# Altium schematic sheet Digital_DSPv3.SchDoc
size 508 x 508 mm
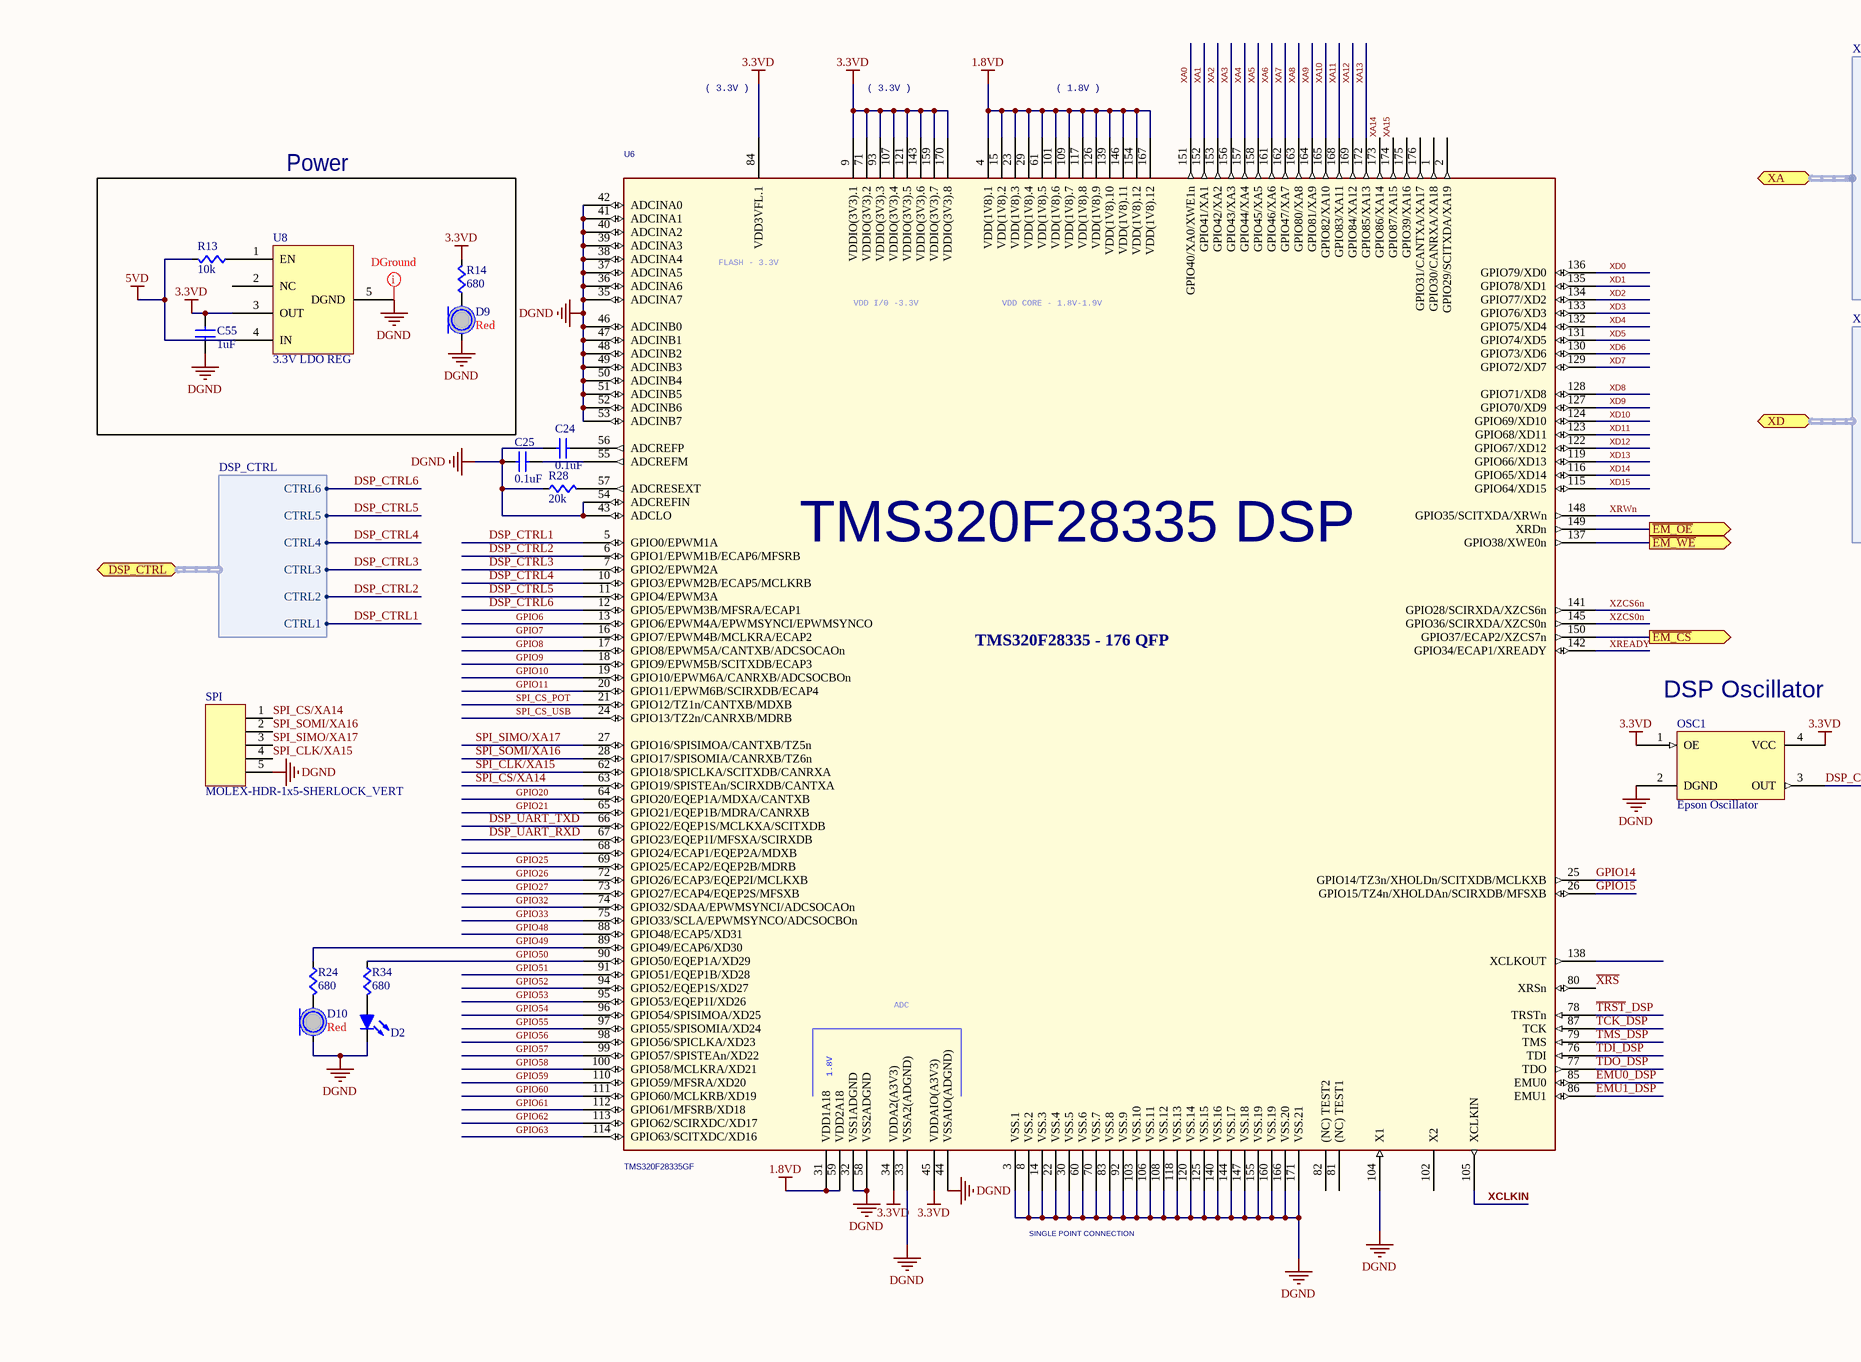
[diagram p0: Digital_DSPv3.SchDoc, top left]
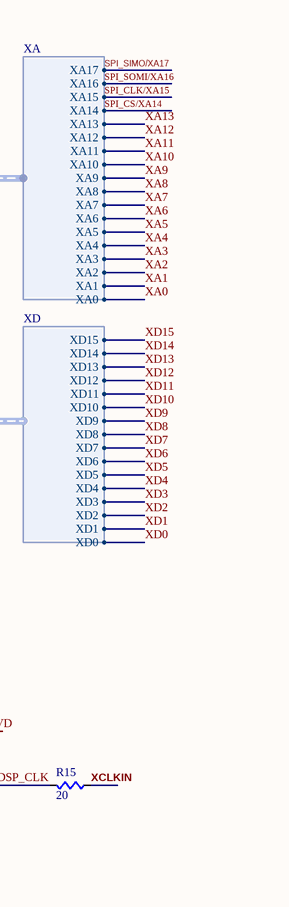
[diagram p1: Digital_DSPv3.SchDoc, top right]
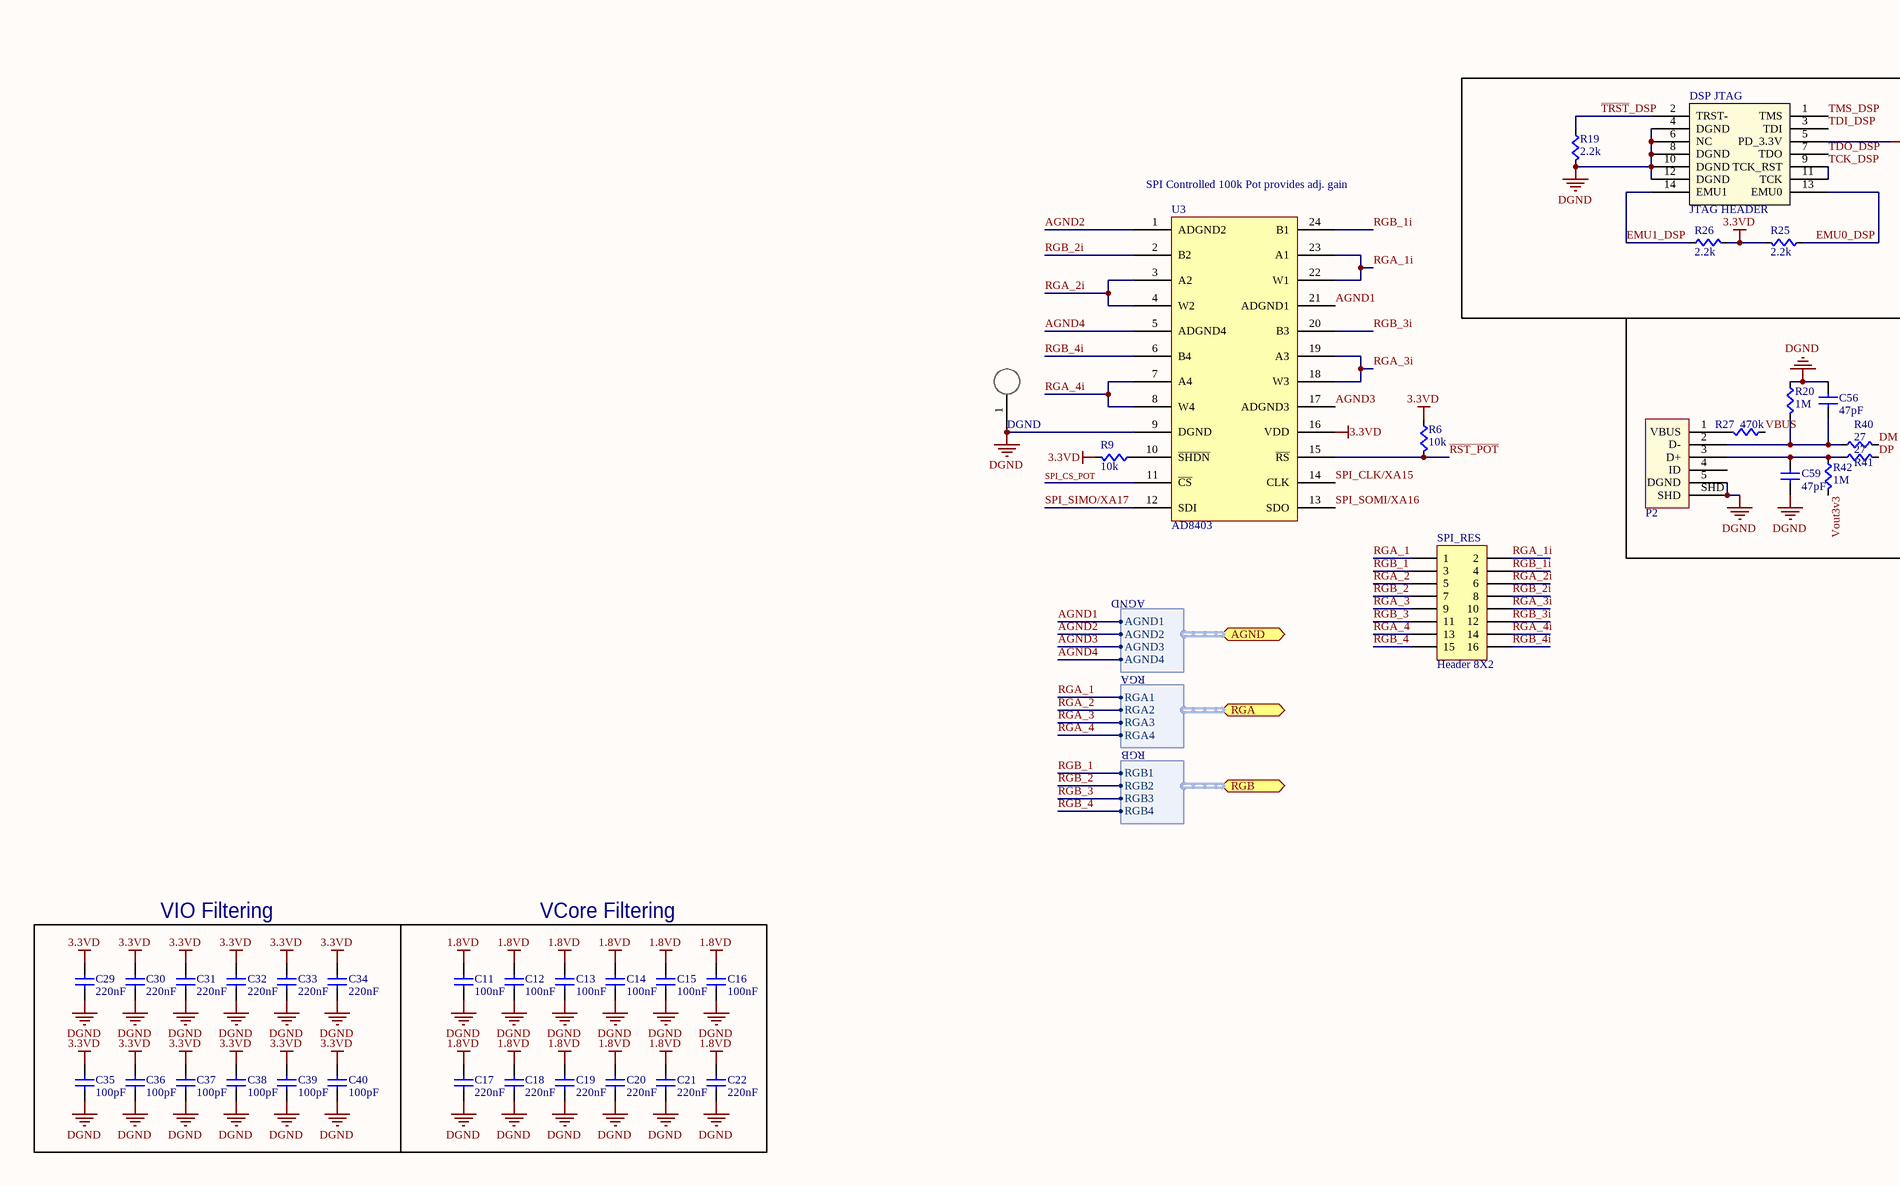
[diagram p2: Digital_DSPv3.SchDoc, bottom left]
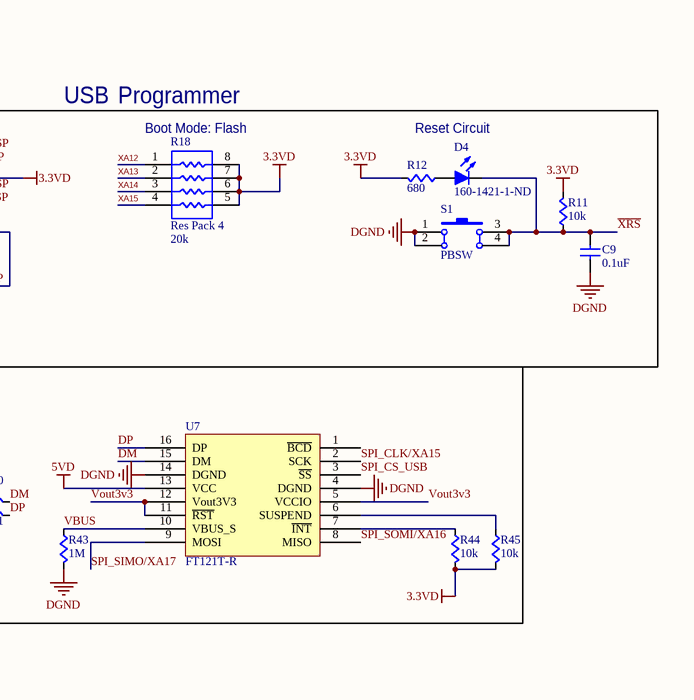
[diagram p3: Digital_DSPv3.SchDoc, bottom right]

## Parts
C9  value 0.1uF  [CAPC0603]  (hidden comment: Cap)
C11  value 100nF  [CAPC0603]  (hidden comment: Cap)
C12  value 100nF  [CAPC0603]  (hidden comment: Cap)
C13  value 100nF  [CAPC0603]  (hidden comment: Cap)
C14  value 100nF  [CAPC0603]  (hidden comment: Cap)
C15  value 100nF  [CAPC0603]  (hidden comment: Cap)
C16  value 100nF  [CAPC0603]  (hidden comment: Cap)
C17  value 220nF  [CAPC0603]  (hidden comment: Cap)
C18  value 220nF  [CAPC0603]  (hidden comment: Cap)
C19  value 220nF  [CAPC0603]  (hidden comment: Cap)
C20  value 220nF  [CAPC0603]  (hidden comment: Cap)
C21  value 220nF  [CAPC0603]  (hidden comment: Cap)
C22  value 220nF  [CAPC0603]  (hidden comment: Cap)
C24  value 0.1uF  [CAPC0603]  (hidden comment: Cap1206)
C25  value 0.1uF  [CAPC0603]  (hidden comment: Cap1206)
C29  value 220nF  [CAPC0603]  (hidden comment: Cap)
C30  value 220nF  [CAPC0603]  (hidden comment: Cap)
C31  value 220nF  [CAPC0603]  (hidden comment: Cap)
C32  value 220nF  [CAPC0603]  (hidden comment: Cap)
C33  value 220nF  [CAPC0603]  (hidden comment: Cap)
C34  value 220nF  [CAPC0603]  (hidden comment: Cap)
C35  value 100pF  [CAPC0603]  (hidden comment: Cap)
C36  value 100pF  [CAPC0603]  (hidden comment: Cap)
C37  value 100pF  [CAPC0603]  (hidden comment: Cap)
C38  value 100pF  [CAPC0603]  (hidden comment: Cap)
C39  value 100pF  [CAPC0603]  (hidden comment: Cap)
C40  value 100pF  [CAPC0603]  (hidden comment: Cap)
C55  value 1uF  [CAPC0603]  (hidden comment: Cap1206)
C56  value 47pF  [CAPC0603]  (hidden comment: Cap1206)
C59  value 47pF  [CAPC0603]  (hidden comment: Cap1206)
D2  LED-RED  [LED0805-RED]  (value not drawn)
D4  Supplier Part Number: 160-1421-1-ND  [LED0805-RED]  (hidden comment: LED-RED)
D9  Color: Red  [LED0805]  (hidden comment: LED)
D10  Color: Red  [LED0805]  (hidden comment: LED)
DGND  Test_Point  [TP]  (value not drawn)
DSP_JTAG  JTAG HEADER  [JTAG HEADER - 14]
OSC1  Epson Oscillator  [Oscillator]
P2  USB Micro  [10118192-0001LF]  (value not drawn)
R6  value 10k  [RES0603]  (hidden comment: Res)
R9  value 10k  [RES0603]  (hidden comment: Res)
R11  value 10k  [RES0603]  (hidden comment: Res)
R12  value 680  [RES0603]  (hidden comment: Res)
R13  value 10k  [RES0603]  (hidden comment: Res)
R14  value 680  [RES0603]  (hidden comment: Res)
R15  value 20  [RES0603]  (hidden comment: Res)
R18  Res Pack 4  value 20k  [SO-8]
R19  value 2.2k  [RES0603]  (hidden comment: Res)
R20  value 1M  [RES0603]  (hidden comment: Res)
R24  value 680  [RES0603]  (hidden comment: Res)
R25  value 2.2k  [RES0603]  (hidden comment: Res)
R26  value 2.2k  [RES0603]  (hidden comment: Res)
R27  value 470k  [RES0603]  (hidden comment: Res)
R28  value 20k  [RES0603]  (hidden comment: Res)
R34  value 680  [RES0603]  (hidden comment: Res)
R40  value 27  [RES0603]  (hidden comment: Res)
R41  value 27  [RES0603]  (hidden comment: Res)
R42  value 1M  [RES0603]  (hidden comment: Res)
R43  value 1M  [RES0603]  (hidden comment: Res)
R44  value 10k  [RES0603]  (hidden comment: Res)
R45  value 10k  [RES0603]  (hidden comment: Res)
S1  PBSW  [PBSW]
SPI  MOLEX-HDR-1x5-SHERLOCK_VERT  [MOLEX-HDR-1X5-SHERLOCK-VERT]
SPI_RES  Header 8X2  [HDR2X8]
U3  AD8403  [SOIC-24n]
U6  TMS320F28335GF  [QFP176]
U7  FT121T-R  [TSSOP-16pin]
U8  3.3V LDO REG  [SOT223-8N]

## Blocks framed on the sheet
Power: C55 D9 R13 R14 U8
VIO Filtering: C29-C40
VCore Filtering: C11-C22

## Ports
AGND (harness AGND), DSP_CTRL (harness DSP_CTRL), RGA (harness RGA), RGB (harness RGB), XA (harness XA), XD (harness XD), ~{EM_CS} (out), ~{EM_OE} (out), ~{EM_WE} (out)

## Harnesses
DSP_CTRL: CTRL1, CTRL2, CTRL3, CTRL4, CTRL5, CTRL6
XA: XA17, XA16, XA15, XA14, XA13, XA12, XA11, XA10, XA9, XA8, XA7, XA6, XA5, XA4, XA3, XA2, XA1, XA0
XD: XD15, XD14, XD13, XD12, XD11, XD10, XD9, XD8, XD7, XD6, XD5, XD4, XD3, XD2, XD1, XD0
AGND: AGND1, AGND2, AGND3, AGND4
RGA: RGA1, RGA2, RGA3, RGA4
RGB: RGB1, RGB2, RGB3, RGB4

## Nets
1: S1.2(A')
1.8VD: C11.1(A) C12.1(A) C13.1(A) C14.1(A) C15.1(A) C16.1(A) C17.1(A) C18.1(A) C19.1(A) C20.1(A) C21.1(A) C22.1(A) U6.4(VDD(1V8).1) U6.15(VDD(1V8).2) U6.23(VDD(1V8).3) U6.29(VDD(1V8).4) U6.31(VDD1A18) U6.59(VDD2A18) U6.61(VDD(1V8).5) U6.101(VDD(1V8).6) U6.109(VDD(1V8).7) U6.117(VDD(1V8).8) U6.126(VDD(1V8).9) U6.139(VDD(1V8).10) U6.146(VDD(1V8).11) U6.154(VDD(1V8).12) U6.167(VDD(1V8).12)
3: S1.4(B')
3.3VD: C29.1(A) C30.1(A) C31.1(A) C32.1(A) C33.1(A) C34.1(A) C35.1(A) C36.1(A) C37.1(A) C38.1(A) C39.1(A) C40.1(A) C55.1(A) DSP_JTAG.5(PD_3.3V) OSC1.1(OE) OSC1.4(VCC) R6.2(B) R9.1(A) R11.1(A) R12.1(A) R14.1(A) R18.5 R18.6 R18.7 R18.8 R25.1(A) R26.1(A) R44.1(A) R45.1(A) U3.16(VDD) U6.9(VDDIO(3V3).1) U6.34(VDDA2(A3V3)) U6.45(VDDAIO(A3V3)) U6.71(VDDIO(3V3).2) U6.84(VDD3VFL.1) U6.93(VDDIO(3V3).3) U6.107(VDDIO(3V3).4) U6.121(VDDIO(3V3).5) U6.143(VDDIO(3V3).6) U6.159(VDDIO(3V3).7) U6.170(VDDIO(3V3).8) U8.3(OUT)
5VD: R13.1(A) U7.13(VCC) U8.4(IN)
DGND: C9.2(B) C11.2(B) C12.2(B) C13.2(B) C14.2(B) C15.2(B) C16.2(B) C17.2(B) C18.2(B) C19.2(B) C20.2(B) C21.2(B) C22.2(B) C24.1(A) C25.1(A) C29.2(B) C30.2(B) C31.2(B) C32.2(B) C33.2(B) C34.2(B) C35.2(B) C36.2(B) C37.2(B) C38.2(B) C39.2(B) C40.2(B) C55.2(B) C56.1(A) C59.2(B) D2.1(K) D9.C D10.C DGND.1 DSP_JTAG.4(DGND) DSP_JTAG.6(NC) DSP_JTAG.8(DGND) DSP_JTAG.10(DGND) DSP_JTAG.12(DGND) OSC1.2(DGND) P2.5(DGND) P2.SHD R19.1(A) R20.2(B) R28.2(B) R43.1(A) S1.1(A) S1.2(A') SPI.5 U3.9(DGND) U6.3(VSS.1) U6.8(VSS.2) U6.14(VSS.3) U6.22(VSS.4) U6.30(VSS.5) U6.32(VSS1ADGND) U6.33(VSSA2(ADGND)) U6.35(ADCINA7) U6.36(ADCINA6) U6.37(ADCINA5) U6.38(ADCINA4) U6.39(ADCINA3) U6.40(ADCINA2) U6.41(ADCINA1) U6.42(ADCINA0) U6.43(ADCLO) U6.44(VSSAIO(ADGND)) U6.46(ADCINB0) U6.47(ADCINB1) U6.48(ADCINB2) U6.49(ADCINB3) U6.50(ADCINB4) U6.51(ADCINB5) U6.52(ADCINB6) U6.53(ADCINB7) U6.54(ADCREFIN) U6.58(VSS2ADGND) U6.60(VSS.6) U6.70(VSS.7) U6.83(VSS.8) U6.92(VSS.9) U6.103(VSS.10) U6.104(X1) U6.106(VSS.11) U6.108(VSS.12) U6.118(VSS.13) U6.120(VSS.14) U6.125(VSS.15) U6.140(VSS.16) U6.144(VSS.17) U6.147(VSS.18) U6.155(VSS.19) U6.160(VSS.19) U6.166(VSS.20) U6.171(VSS.21) U7.4(DGND) U7.14(DGND) U8.5(DGND)
AGND1: U3.21(ADGND1) ; port AGND.AGND1
AGND2: U3.1(ADGND2) ; port AGND.AGND2
AGND3: U3.17(ADGND3) ; port AGND.AGND3
AGND4: U3.5(ADGND4) ; port AGND.AGND4
DM: R40.1(A) U7.15(DM)
DP: R41.1(A) U7.16(DP)
DSP_CLK: OSC1.3(OUT) R15.1(A)
DSP_CTRL1: U6.5(GPIO0/EPWM1A) ; port DSP_CTRL.CTRL1
DSP_CTRL2: U6.6(GPIO1/EPWM1B/ECAP6/MFSRB) ; port DSP_CTRL.CTRL2
DSP_CTRL3: U6.7(GPIO2/EPWM2A) ; port DSP_CTRL.CTRL3
DSP_CTRL4: U6.10(GPIO3/EPWM2B/ECAP5/MCLKRB) ; port DSP_CTRL.CTRL4
DSP_CTRL5: U6.11(GPIO4/EPWM3A) ; port DSP_CTRL.CTRL5
DSP_CTRL6: U6.12(GPIO5/EPWM3B/MFSRA/ECAP1) ; port DSP_CTRL.CTRL6
DSP_UART_RXD: U6.67(GPIO23/EQEP1I/MFSXA/SCIRXDB)
DSP_UART_TXD: U6.66(GPIO22/EQEP1S/MCLKXA/SCITXDB)
~{EM_CS}: U6.150(GPIO37/ECAP2/XZCS7n) ; port ~{EM_CS}
~{EM_OE}: U6.149(XRDn) ; port ~{EM_OE}
~{EM_WE}: U6.137(GPIO38/XWE0n) ; port ~{EM_WE}
EMU0_DSP: DSP_JTAG.13(EMU0) R25.2(B) U6.85(EMU0)
EMU1_DSP: DSP_JTAG.14(EMU1) R26.2(B) U6.86(EMU1)
GPIO6: U6.13(GPIO6/EPWM4A/EPWMSYNCI/EPWMSYNCO)
GPIO7: U6.16(GPIO7/EPWM4B/MCLKRA/ECAP2)
GPIO8: U6.17(GPIO8/EPWM5A/CANTXB/ADCSOCAOn)
GPIO9: U6.18(GPIO9/EPWM5B/SCITXDB/ECAP3)
GPIO10: U6.19(GPIO10/EPWM6A/CANRXB/ADCSOCBOn)
GPIO11: U6.20(GPIO11/EPWM6B/SCIRXDB/ECAP4)
GPIO14: U6.25(GPIO14/TZ3n/XHOLDn/SCITXDB/MCLKXB)
GPIO15: U6.26(GPIO15/TZ4n/XHOLDAn/SCIRXDB/MFSXB)
GPIO20: U6.64(GPIO20/EQEP1A/MDXA/CANTXB)
GPIO21: U6.65(GPIO21/EQEP1B/MDRA/CANRXB)
GPIO25: U6.69(GPIO25/ECAP2/EQEP2B/MDRB)
GPIO26: U6.72(GPIO26/ECAP3/EQEP2I/MCLKXB)
GPIO27: U6.73(GPIO27/ECAP4/EQEP2S/MFSXB)
GPIO32: U6.74(GPIO32/SDAA/EPWMSYNCI/ADCSOCAOn)
GPIO33: U6.75(GPIO33/SCLA/EPWMSYNCO/ADCSOCBOn)
GPIO48: U6.88(GPIO48/ECAP5/XD31)
GPIO49: R24.2(B) U6.89(GPIO49/ECAP6/XD30)
GPIO50: R34.2(B) U6.90(GPIO50/EQEP1A/XD29)
GPIO51: U6.91(GPIO51/EQEP1B/XD28)
GPIO52: U6.94(GPIO52/EQEP1S/XD27)
GPIO53: U6.95(GPIO53/EQEP1I/XD26)
GPIO54: U6.96(GPIO54/SPISIMOA/XD25)
GPIO55: U6.97(GPIO55/SPISOMIA/XD24)
GPIO56: U6.98(GPIO56/SPICLKA/XD23)
GPIO57: U6.99(GPIO57/SPISTEAn/XD22)
GPIO58: U6.100(GPIO58/MCLKRA/XD21)
GPIO59: U6.110(GPIO59/MFSRA/XD20)
GPIO60: U6.111(GPIO60/MCLKRB/XD19)
GPIO61: U6.112(GPIO61/MFSRB/XD18)
GPIO62: U6.113(GPIO62/SCIRXDC/XD17)
GPIO63: U6.114(GPIO63/SCITXDC/XD16)
~{RST_POT}: R6.1(A) U3.15(~{RS})
RGA_1: SPI_RES.1 ; port RGA.RGA1
RGA_1i: SPI_RES.2 U3.22(W1) U3.23(A1)
RGA_2: SPI_RES.5 ; port RGA.RGA2
RGA_2i: SPI_RES.6 U3.3(A2) U3.4(W2)
RGA_3: SPI_RES.9 ; port RGA.RGA3
RGA_3i: SPI_RES.10 U3.18(W3) U3.19(A3)
RGA_4: SPI_RES.13 ; port RGA.RGA4
RGA_4i: SPI_RES.14 U3.7(A4) U3.8(W4)
RGB_1: SPI_RES.3 ; port RGB.RGB1
RGB_1i: SPI_RES.4 U3.24(B1)
RGB_2: SPI_RES.7 ; port RGB.RGB2
RGB_2i: SPI_RES.8 U3.2(B2)
RGB_3: SPI_RES.11 ; port RGB.RGB3
RGB_3i: SPI_RES.12 U3.20(B3)
RGB_4: SPI_RES.15 ; port RGB.RGB4
RGB_4i: SPI_RES.16 U3.6(B4)
SPI_CLK/XA15: SPI.4 U3.14(CLK) U6.62(GPIO18/SPICLKA/SCITXDB/CANRXA) U7.2(SCK) ; port XA.XA15
SPI_CS/XA14: SPI.1 U6.63(GPIO19/SPISTEAn/SCIRXDB/CANTXA) ; port XA.XA14
SPI_CS_POT: U3.11(~{CS}) U6.21(GPIO12/TZ1n/CANTXB/MDXB)
SPI_CS_USB: U6.24(GPIO13/TZ2n/CANRXB/MDRB) U7.3(~{SS})
SPI_SIMO/XA17: SPI.3 U3.12(SDI) U6.27(GPIO16/SPISIMOA/CANTXB/TZ5n) U7.9(MOSI) ; port XA.XA17
SPI_SOMI/XA16: SPI.2 U3.13(SDO) U6.28(GPIO17/SPISOMIA/CANRXB/TZ6n) U7.8(MISO) ; port XA.XA16
~{TRST}_DSP: DSP_JTAG.2(TRST-) R19.2(B) U6.78(TRSTn)
TCK_DSP: DSP_JTAG.9(TCK_RST) DSP_JTAG.11(TCK) U6.87(TCK)
TDI_DSP: DSP_JTAG.3(TDI) U6.76(TDI)
TDO_DSP: DSP_JTAG.7(TDO) U6.77(TDO)
TMS_DSP: DSP_JTAG.1(TMS) U6.79(TMS)
VBUS: R27.2(B) R43.2(B) U7.10(VBUS_S)
Vout3v3: R42.1(A) U7.5(VCCIO) U7.11(~{RST}) U7.12(Vout3V3)
~{XRS}: C9.1(A) D4.1(K) R11.2(B) S1.3(B) S1.4(B') U6.80(XRSn)
XA0: U6.151(GPIO40/XA0/XWE1n) ; port XA.XA0
XA1: U6.152(GPIO41/XA1) ; port XA.XA1
XA2: U6.153(GPIO42/XA2) ; port XA.XA2
XA3: U6.156(GPIO43/XA3) ; port XA.XA3
XA4: U6.157(GPIO44/XA4) ; port XA.XA4
XA5: U6.158(GPIO45/XA5) ; port XA.XA5
XA6: U6.161(GPIO46/XA6) ; port XA.XA6
XA7: U6.162(GPIO47/XA7) ; port XA.XA7
XA8: U6.163(GPIO80/XA8) ; port XA.XA8
XA9: U6.164(GPIO81/XA9) ; port XA.XA9
XA10: U6.165(GPIO82/XA10) ; port XA.XA10
XA11: U6.168(GPIO83/XA11) ; port XA.XA11
XA12: R18.1 U6.169(GPIO84/XA12) ; port XA.XA12
XA13: R18.2 U6.172(GPIO85/XA13) ; port XA.XA13
XA14: R18.3 U6.173(GPIO86/XA14)
XA15: R18.4 U6.174(GPIO87/XA15)
XCLKIN: R15.2(B) U6.105(XCLKIN)
XD0: U6.136(GPIO79/XD0) ; port XD.XD0
XD1: U6.135(GPIO78/XD1) ; port XD.XD1
XD2: U6.134(GPIO77/XD2) ; port XD.XD2
XD3: U6.133(GPIO76/XD3) ; port XD.XD3
XD4: U6.132(GPIO75/XD4) ; port XD.XD4
XD5: U6.131(GPIO74/XD5) ; port XD.XD5
XD6: U6.130(GPIO73/XD6) ; port XD.XD6
XD7: U6.129(GPIO72/XD7) ; port XD.XD7
XD8: U6.128(GPIO71/XD8) ; port XD.XD8
XD9: U6.127(GPIO70/XD9) ; port XD.XD9
XD10: U6.124(GPIO69/XD10) ; port XD.XD10
XD11: U6.123(GPIO68/XD11) ; port XD.XD11
XD12: U6.122(GPIO67/XD12) ; port XD.XD12
XD13: U6.119(GPIO66/XD13) ; port XD.XD13
XD14: U6.116(GPIO65/XD14) ; port XD.XD14
XD15: U6.115(GPIO64/XD15) ; port XD.XD15
XREADY: U6.142(GPIO34/ECAP1/XREADY)
XRWn: U6.148(GPIO35/SCITXDA/XRWn)
XZCS0n: U6.145(GPIO36/SCIRXDA/XZCS0n)
XZCS6n: U6.141(GPIO28/SCIRXDA/XZCS6n)
NetC24_2: C24.2(B) U6.56(ADCREFP)
NetC25_2: C25.2(B) U6.55(ADCREFM)
NetC56_2: C56.2(B) P2.2(D-) R20.1(A) R40.2(B)
NetC59_1: C59.1(A) P2.3(D+) R41.2(B) R42.2(B)
NetD2_2: D2.2(A) R34.1(A)
NetD4_2: D4.2(A) R12.2(B)
NetD9_A: D9.A R14.2(B)
NetD10_A: D10.A R24.1(A)
NetP2_1: P2.1(VBUS) R27.1(A)
NetR9_2: R9.2(B) U3.10(~{SHDN})
NetR13_2: R13.2(B) U8.1(EN)
NetR28_1: R28.1(A) U6.57(ADCRESEXT)
NetR44_2: R44.2(B) U7.7(~{INT})
NetR45_2: R45.2(B) U7.6(SUSPEND)

Not connected (* = marked no-connect by the designer): P2 4(ID); U6 1(GPIO30/CANRXA/XA18) 2(GPIO29/SCITXDA/XA19) 68(GPIO24/ECAP1/EQEP2A/MDXB) 81((NC)_TEST1) 82((NC)_TEST2) 102(X2) 138(XCLKOUT) 175(GPIO39/XA16) 176(GPIO31/CANTXA/XA17); U7 1(~{BCD}); U8 2(NC)

## Layout directives
net class DGround: DGND

## Notes on the sheet
- ( 3.3V )
- ( 1.8V )
- (near U6) TMS320F28335 DSP
- (near OSC1) DSP Oscillator
- SINGLE POINT CONNECTION
- USB
- Programmer
- (near R18) Boot Mode: Flash
- Reset Circuit
- (near U3) SPI Controlled 100k Pot provides adj. gain
- (in symbol TMS320F283XXPGF_23) FLASH - 3.3V; VDD I/0 -3.3V; VDD CORE - 1.8V-1.9V; TMS320F28335 - 176 QFP; ADC; 1.8V

## Library data of the parts
C24 C25 C55 C56 C59 = Cap1206: CAP CER 1UF 50V 10% X7R 1206; Supplier 1: Digi-Key; Supplier Part Number 1: 587-2230-1-ND
D2 D4 = LED-RED: Light Emitting Diode - RED; Manufacturer Part Number: LTST-C171CKT; Manufacturer: Lite-On Inc; Voltage - Forward (Vf) Typ: 1.8V; Current - Test: 20mA; Millicandela Rating: 25mcd; Viewing Angle: 130°; Color: Red; Supplier: Digi-Key; Package / Case: 0805 (2012 Metric)
  D2: Supplier Part Number: 160-1421-1-ND
DGND = Test_Point: TEST POINT PC COMPACT .063"D; Supplier 1: Digi-Key; Supplier Part Number 1: 5006K-ND
DSP_JTAG = JTAG-TI_14: 14 Pin JTAG Header
OSC1 = Oscillator: 15Mhz Epson Clock; Digikey #: SE2826CT-ND
P2 = USB Micro: USB Mini B Metal Shield SMT; Supplier 1: Digi-Key; Supplier Part Number 1: 609-4613-1-ND
R18 = Res Pack 4: 4 Isolated Resistor Network; Published: 24-Mar-1999; LatestRevisionDate: 17-Jul-2002; LatestRevisionNote: Re-released for DXP Platform.; PackageReference: SO-16; Publisher: Altium Limited; Digikey #: YC164J-20KCT-ND
S1 = SW-PB: Push Button Switch; Manufacturer: Panasonic Electronic Components; Manufacturer Part Number: EVQ-9P105M; Outline: 6.10mm x 6.00mm; Actuator Orientation: Top Actuated; Actuator Height off PCB, from Pins: 5.00mm; Published: 24-Mar-1999; LatestRevisionDate: 17-Jul-2002; LatestRevisionNote: Re-released for DXP Platform.; PackageReference: SPST-2; Publisher: Altium Limited; PackageDescription: Switch; 2 Leads; Supplier: Digi-Key; Supplier Part Number: P13586SCT-ND
SPI = MOLEX-HDR-1x5-SHERLOCK_VERT: Header, Molex, 2mm Pitch Sherlock Header, Single Row, Vertical, 5 Circuits, Length 3.3mm, 0353620550; Manufacturer Part Number: *; Order Part Number: *
SPI_RES = Header 8X2: Header, 8-Pin, Dual row; LatestRevisionDate: 17-Jul-2002; LatestRevisionNote: Re-released for DXP Platform.; Publisher: Altium Limited
U3 = AD8403: IC POT DGTL 8BIT 100K 4CH 24SOIC; Supplier 1: Digi-Key; Supplier Part Number 1: AD8403ARZ100-ND
U6 = TMS320F283XXPGF_23: Texas Instruments F28335; Digikey #: 296-23660-ND
U7 = FT121T-R: IC USB CONTROLLER SPI 16-TSSOP; Supplier 1: Digi-Key; Supplier Part Number 1: 768-1167-1-ND
U8 = LP38691: IC REG LDO 3.3V 0.5A SOT223-5; Supplier 1: Digi-Key; Supplier Part Number 1: LP38693MP-3.3/NOPBCT-ND
C9 C11-C22 C29-C40 = Cap: Supplier 1: Digi-Key; Supplier Part Number 1: 1276-1000-1-ND
D9 D10 = LED: Supplier 1: Digi-Key; Supplier Part Number 1: 754-1122-1-ND
R6 R9 R11-R15 R19 R20 R24-R28 R34 R40-R45 = Res: Supplier 1: Digi-Key; Supplier Part Number 1: RMCF0603JT10K0CT-ND